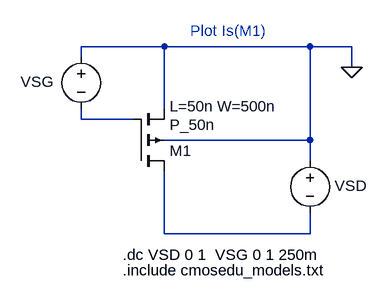
[diagram p0: schematic Fig6_19_PMOS_ID_VSD.asc]
Fig6_19_PMOS_ID_VSD.asc, the LTspice schematic file:
Version 4
SHEET 1 1224 688
WIRE 448 16 320 16
WIRE 672 16 448 16
WIRE 736 16 672 16
WIRE 320 32 320 16
WIRE 736 48 736 16
WIRE 448 112 448 16
WIRE 320 128 320 112
WIRE 400 128 320 128
WIRE 672 160 672 16
WIRE 672 160 448 160
WIRE 672 192 672 160
WIRE 448 304 448 208
WIRE 672 304 672 272
WIRE 672 304 448 304
FLAG 736 48 0
SYMBOL voltage 320 16 R0
WINDOW 0 -93 54 Left 2
WINDOW 3 24 104 Invisible 2
SYMATTR InstName VSG
SYMATTR Value 0
SYMBOL voltage 672 176 R0
WINDOW 123 0 0 Left 2
WINDOW 39 0 0 Left 2
WINDOW 0 38 54 Left 2
WINDOW 3 24 104 Invisible 2
SYMATTR InstName VSD
SYMATTR Value 0
SYMBOL pmos4 400 208 M180
WINDOW 123 56 100 Left 2
SYMATTR Value2 L=50n W=500n
SYMATTR InstName M1
SYMATTR Value P_50n
TEXT 384 336 Left 2 !.dc VSD 0 1  VSG 0 1 250m
TEXT 384 360 Left 2 !.include cmosedu_models.txt
TEXT 488 -8 Left 2 ;Plot Is(M1)

The netlist it stands for:
* Fig6_19_PMOS_ID_VSD.asc
VSG 0 N001 0
VSD 0 N002 0
M1 N002 N001 0 0 P_50n L=50n W=500n
.model NMOS NMOS
.model PMOS PMOS
.lib standard.mos
.dc VSD 0 1  VSG 0 1 250m
.include cmosedu_models.txt
* Plot Is(M1)
.backanno
.end